# EAGLE schematic EMG_FSR (EAGLE 9.6.2)
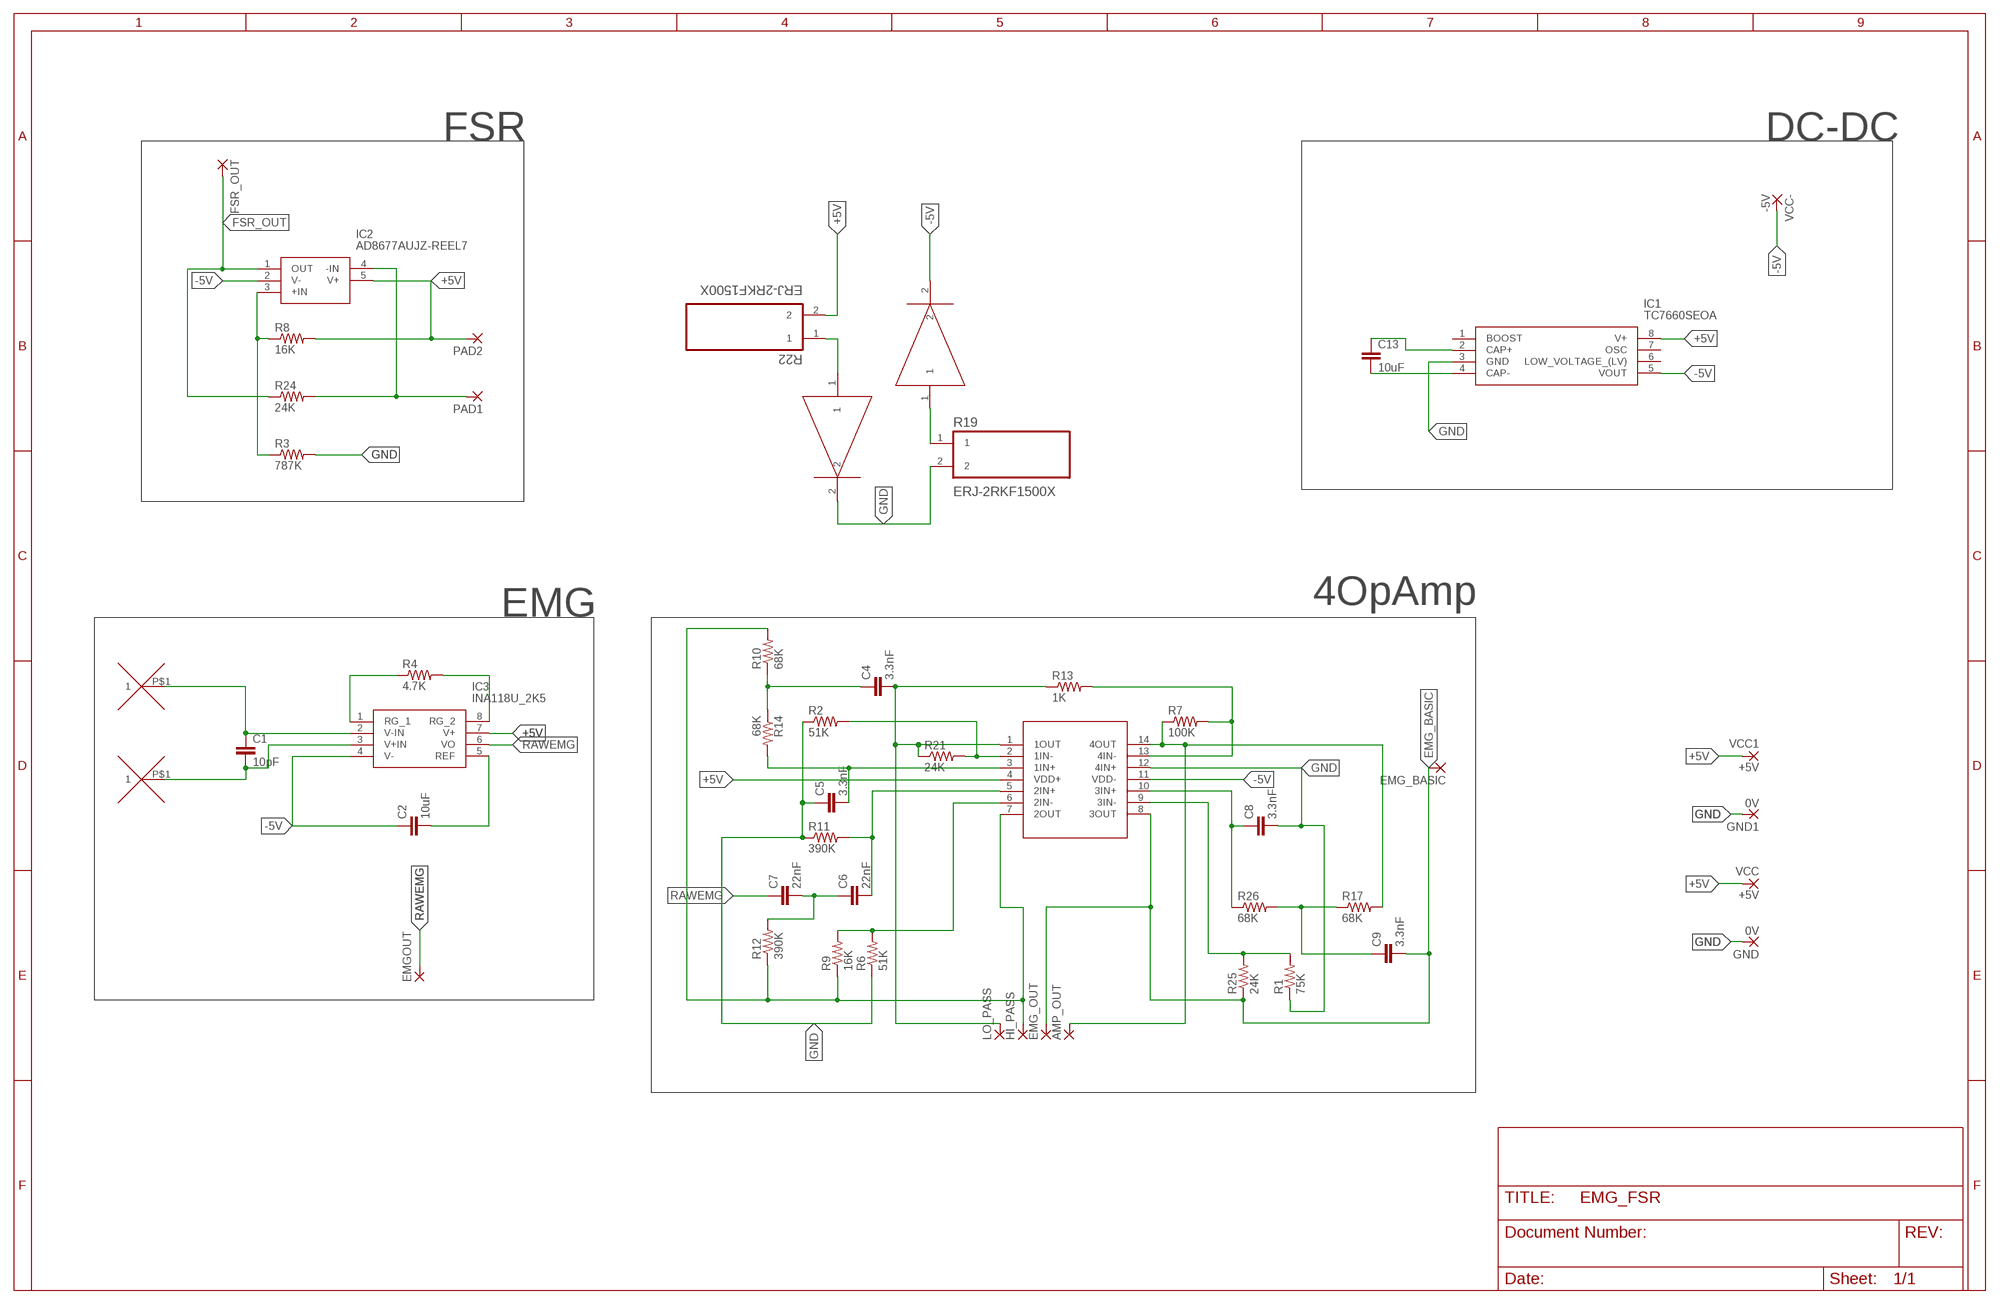
[diagram p0: schematic, sheet 1]

## Parts
AMP_OUT  1,6/0,8  [1,6/0,8]
C1  10pF  C-EUHPC0201  [HPC0201]
C2  10uF  C-EUC0805  [C0805]
C4  3.3nF  C-EUC1206  [C1206]
C5  3.3nF  C-EUC1206  [C1206]
C6  22nF  C-EUC0805  [C0805]
C7  22nF  C-EUC0805  [C0805]
C8  3.3nF  C-EUC1206  [C1206]
C9  3.3nF  C-EUC1206  [C1206]
C13  10uF  C-EUC0805K  [C0805K]
EMG_BASIC  1,6/0,8  [1,6/0,8]
EMG_OUT  1,6/0,8  [1,6/0,8]
EMGOUT  1,6/0,8  [1,6/0,8]
FSR_OUT  1,6/0,8  [1,6/0,8]
GND  0V  1,6/0,8  [1,6/0,8]
GND1  0V  1,6/0,8  [1,6/0,8]
HI_PASS  1,6/0,8  [1,6/0,8]
IC1  TC7660SEOA  [SOIC127P600X175-8N]
IC2  AD8677AUJZ-REEL7  [SOT95P280X100-5N]
IC3  INA118U_2K5  [SOIC127P600X175-8N]
LO_PASS  1,6/0,8  [1,6/0,8]
PAD1  SMD2  [SMD1,27-2,54]
PAD2  SMD2  [SMD1,27-2,54]
R1  75K  R-US_R0402  [R0402]
R2  51K  R-US_R0402  [R0402]
R3  787K  R-US_R0805  [R0805]
R4  4.7K  R-US_R0402  [R0402]
R6  51K  R-US_R0402  [R0402]
R7  100K  R-US_R1005  [R1005]
R8  16K  R-US_R0402  [R0402]
R9  16K  R-US_R0402  [R0402]
R10  68K  R-US_R0402  [R0402]
R11  390K  R-US_R0603  [R0603]
R12  390K  R-US_R0603  [R0603]
R13  1K  R-US_R0402  [R0402]
R14  68K  R-US_R0402  [R0402]
R17  68K  R-US_R0402  [R0402]
R19  ERJ-2RKF1500X  [RESC1005X40N]
R20  RESC0402X40N  [RESC0402X40N]
R21  24K  R-US_R0402  [R0402]
R22  ERJ-2RKF1500X  [RESC1005X40N]
R24  24K  R-US_R0402  [R0402]
R25  24K  R-US_R0402  [R0402]
R26  68K  R-US_R0402  [R0402]
RED  RESC0402X40N  [RESC0402X40N]
U$1  TLC2274-HT  [SOP65P640X120-14N]
U$2  EMG_VIA  [EMG_VIA]
U$3  EMG_VIA  [EMG_VIA]
VCC  +5V  1,6/0,8  [1,6/0,8]
VCC1  +5V  1,6/0,8  [1,6/0,8]
VCC-  -5V  1,6/0,8  [1,6/0,8]

## Nets
+5V: IC1.8(V+) IC2.5(V+) IC3.7(V+) PAD2.1(P) R8.2 R22.2 U$1.4(VDD+) VCC1.1(P) VCC.1(P)
-5V: C2.1 IC1.5(VOUT) IC2.2(V-) IC3.4(V-) R20.2 U$1.11(VDD-) VCC-.1(P)
EMG_BASIC: C9.2 EMG_BASIC.1(P) EMG_OUT.1(P) R25.1 U$1.8(3OUT)
FSR_OUT: FSR_OUT.1(P) IC2.1(OUT) R24.1
GND: C5.1 C8.2 GND1.1(P) GND.1(P) IC1.3(GND) R1.1 R2.1 R3.2 R6.1 R11.1 R19.2 RED.2 U$1.12(4IN+)
N$1: C13.1 IC1.2(CAP+)
N$2: C13.2 IC1.4(CAP-)
N$3: C1.1 IC3.2(V-IN) U$2.P$1
N$4: R22.1 RED.1
N$5: C1.2 IC3.3(V+IN) U$3.P$1
N$6: R19.1 R20.1
N$7: IC2.4(-IN) PAD1.1(P) R24.2
N$10: IC2.3(+IN) R3.1 R8.1
N$11: C2.2 IC3.5(REF)
N$12: IC3.1(RG_1) R4.1
N$13: IC3.8(RG_2) R4.2
N$14: C4.2 LO_PASS.1(P) R13.1 R21.1 U$1.1(1OUT)
N$17: AMP_OUT.1(P) R7.1 R17.2 U$1.14(4OUT)
N$18: R7.2 R13.2 U$1.13(4IN-)
N$19: R2.2 R21.2 U$1.2(1IN-)
N$20: C5.2 R14.2 U$1.3(1IN+)
N$21: C4.1 R10.1 R14.1
N$23: C6.1 C7.2 R12.2
N$24: C6.2 R11.2 U$1.5(2IN+)
N$26: R6.2 R9.2 U$1.6(2IN-)
N$27: C9.1 R17.1 R26.2
N$28: C8.1 R26.1 U$1.10(3IN+)
N$30: R1.2 R25.2 U$1.9(3IN-)
PIN7: HI_PASS.1(P) R9.1 R10.2 R12.1 U$1.7(2OUT)
RAWEMG: C7.1 EMGOUT.1(P) IC3.6(VO)
Unconnected: IC1.1(BOOST) IC1.6(LOW_VOLTAGE_(LV)) IC1.7(OSC)

## Notes on the sheet
- FSR | DC-DC
- EMG | 4OpAmp

## Library data of the parts
AMP_OUT EMG_BASIC EMG_OUT EMGOUT FSR_OUT GND GND1 HI_PASS LO_PASS VCC VCC1 VCC- = wirepad:1,6/0,8: THROUGH-HOLE PAD
C1 C2 C13 = rcl@1:C-EU: CAPACITOR, European symbol; SPICEPREFIX: C
C4-C9 = rcl:C-EU: CAPACITOR, European symbol; SPICEPREFIX: C
IC1 = TC7660SEOA:TC7660SEOA: DC-TO-DC VOLTAGE CONVERTER Source: Datasheet <http://componentsearchengine.com/Datasheets/1/TC7660SEOA.pdf>; ARROW_PART_NUMBER: TC7660SEOA; ARROW_PRICE-STOCK: https://www.arrow.com/en/products/tc7660seoa/microchip-technology; DESCRIPTION: DC-TO-DC VOLTAGE CONVERTER; HEIGHT: 1.75mm; MANUFACTURER_NAME: Microchip; MANUFACTURER_PART_NUMBER: TC7660SEOA; MOUSER_PART_NUMBER: 579-TC7660SEOA; MOUSER_PRICE-STOCK: https://www.mouser.co.uk/ProductDetail/Microchip-Technology/TC7660SEOA?qs=cQYLKLPzRJl3hJI5k2EAHg%3D%3D
IC2 = AD8677AUJZ-REEL7:AD8677AUJZ-REEL7: Precision Amplifiers 130uV Max Offset VTG Source: Datasheet <http://www.analog.com/media/en/technical-documentation/data-sheets/AD8677.pdf>; ARROW_PART_NUMBER: AD8677AUJZ-REEL7; ARROW_PRICE-STOCK: https://www.arrow.com/en/products/ad8677aujz-reel7/analog-devices; DESCRIPTION: Precision Amplifiers 130uV Max Offset VTG; HEIGHT: 1mm; MANUFACTURER_NAME: Analog Devices; MANUFACTURER_PART_NUMBER: AD8677AUJZ-REEL7; MOUSER_PART_NUMBER: 584-AD8677AUJZ-R7; MOUSER_PRICE-STOCK: https://www.mouser.co.uk/ProductDetail/Analog-Devices/AD8677AUJZ-REEL7?qs=%2FtpEQrCGXCxIKHu%2FfOAijA%3D%3D
IC3 = INA118U_2K5:INA118U_2K5: Precision, Low Power Instrumentation Amplifier Source: Datasheet <http://www.ti.com/lit/gpn/INA118>; ARROW_PART_NUMBER: INA118U/2K5; ARROW_PRICE-STOCK: https://www.arrow.com/en/products/ina118u2k5/texas-instruments; DESCRIPTION: Precision, Low Power Instrumentation Amplifier; HEIGHT: 1.75mm; MANUFACTURER_NAME: Texas Instruments; MANUFACTURER_PART_NUMBER: INA118U/2K5; MOUSER_PART_NUMBER: 595-INA118U/2K5; MOUSER_PRICE-STOCK: https://www.mouser.co.uk/ProductDetail/Texas-Instruments/INA118U-2K5?qs=VBduBm9rCJRVtE6eJbSA%2Fg%3D%3D
PAD1 PAD2 = wirepad:SMD2: SMD PAD
R1 R2 R6 R8-R10 R13 R14 R17 R21 R24-R26 = adafruit@2:R-US_: RESISTOR, American symbol
R3 = rcl:R-US_: RESISTOR, American symbol; SPICEPREFIX: R
R4 R7 R12 = adafruit@1:R-US_: RESISTOR, American symbol
R11 = adafruit:R-US_: RESISTOR, American symbol
R19 R22 = ERJ-2RKF1500X:ERJ-2RKF1500X; DESCRIPTION: 150 Ohms ±1% 0.1W, 1/10W Chip Resistor 0402 (1005 Metric) Automotive AEC-Q200 Thick Film; DIGI-KEY_PART_NUMBER: P150LCT-ND; MF: Panasonic Electronic; MP: ERJ-2RKF1500X; PACKAGE: 1005 Panasonic Electronic Components; PURCHASE-URL: https://pricing.snapeda.com/search/part/ERJ-2RKF1500X/?ref=eda
R20 RED = RESC0402X40N:RESC0402X40N; A_MAX: 0.4; A_MIN: 0.4; A_NOM: 0.4; D_MAX: 1.1; D_MIN: 0.95; D_NOM: 1.0; E_MAX: 0.55; E_MIN: 0.45; E_NOM: 0.5; L1_MAX: 0.3; L1_MIN: 0.15; L1_NOM: 0.25; L_MAX: 0.3; L_MIN: 0.15; L_NOM: 0.25; MANUFACTURER: KOA; STANDARD: IPC 7351B
U$1 = TLC2274-HT:TLC2274-HT
U$2 U$3 = EMG_VIA:EMG_VIA